# Altium schematic sheet PLWD_GNSS.SchDoc
size A4; SheetNumber: 4; SheetTotal: 6
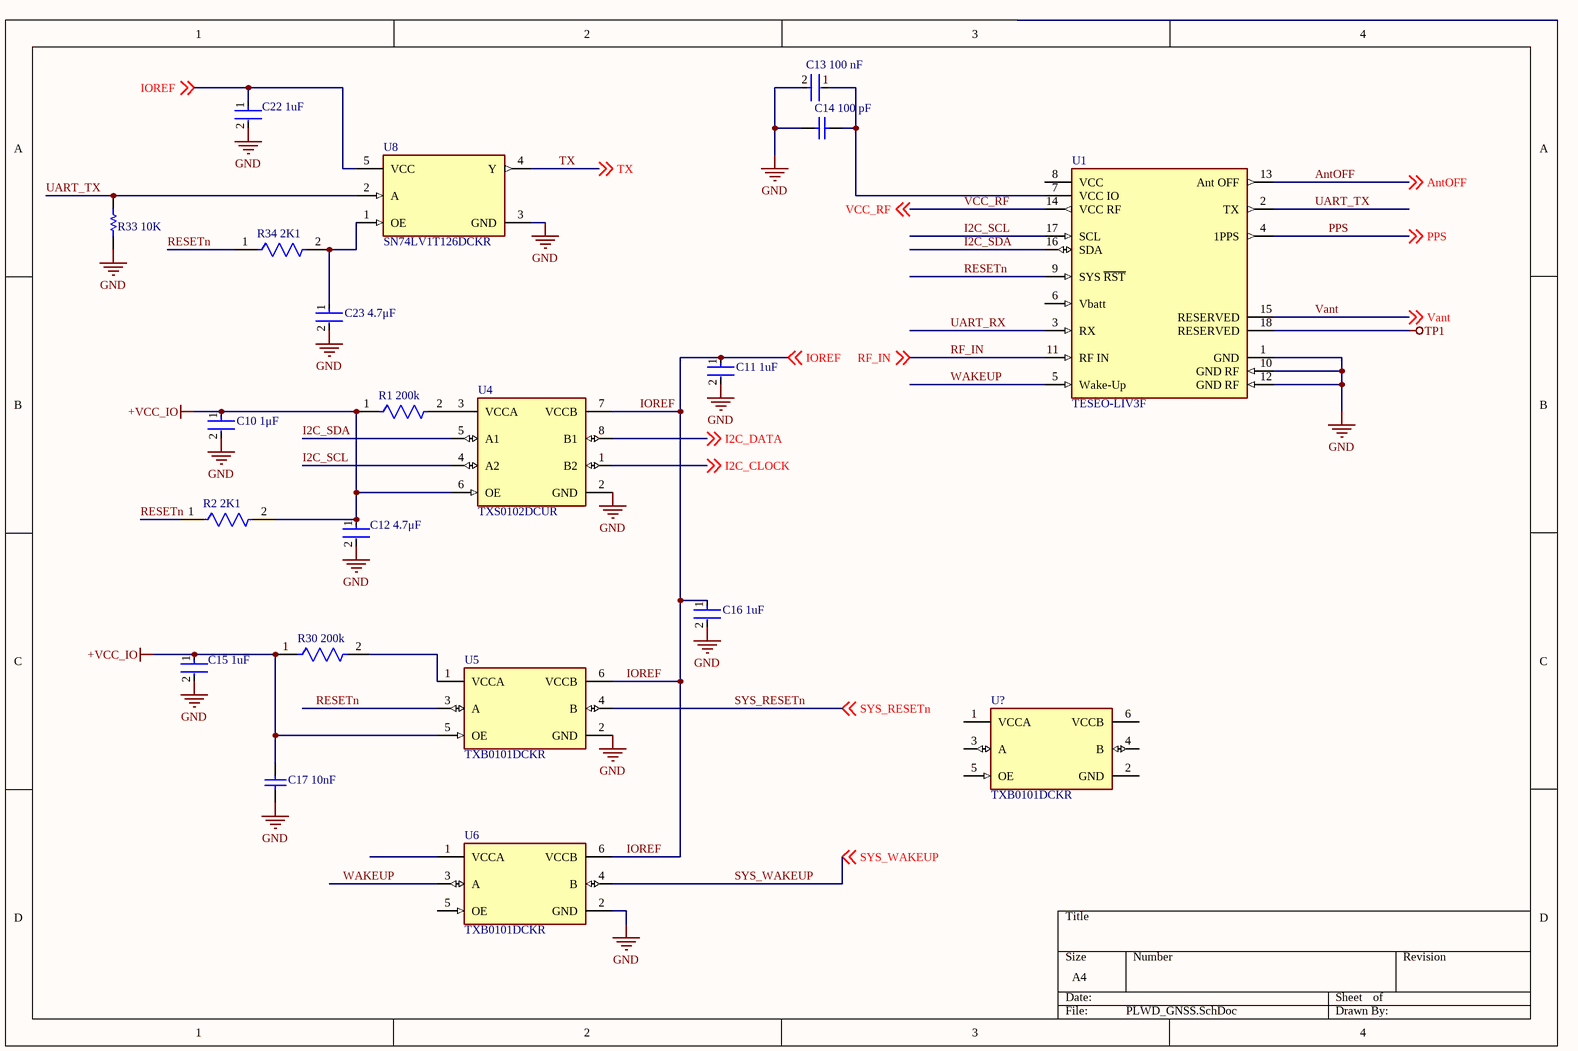
[diagram p0: PLWD_GNSS.SchDoc]

## Parts
C10_1μF  GRM155R60J475ME47D  [FP-GRM155-0_1-IPC_B]  (value not drawn)
C11_1uF  GRM155R61A105KE15D  [FP-GRM15-0_1-MFG]  (value not drawn)
C12_4.7μF  GRM155R60J475ME47D  [FP-GRM155-0_1-IPC_B]  (value not drawn)
C13_100_nF  GRM155R71C104KA88D  [FP-GRM15-MFG]  (value not drawn)
C14_100_pF  GRM1555C1H101JA01D  [CAPC1005X55X25ML05T10]  (value not drawn)
C15_1uF  GRM155R61A105KE15D  [FP-GRM15-0_1-MFG]  (value not drawn)
C16_1uF  GRM155R61A105KE15D  [FP-GRM15-0_1-MFG]  (value not drawn)
C17_10nF  GRM155R71E103KA01D  [CAPC1005X55X25LL05T10]  (value not drawn)
C22_1uF  GRM155R61A105KE15D  [FP-GRM15-0_1-MFG]  (value not drawn)
C23_4.7μF  GRM155R60J475ME47D  [FP-GRM155-0_1-IPC_B]  (value not drawn)
R1_200k  CRCW0603200KFKEAHP  [FP-CRCW0603-HPe3-MFG]  (value not drawn)
R2_2K1  CRCW06032K10FKEA  [FP-CRCW0603-e3-IPC_A]  (value not drawn)
R30_200k  CRCW2512200KFKEG  [FP-CRCW2512-e3-IPC_B]  (value not drawn)
R33_10K  ERJ3EKF1002V  [RESC1609X55X30LL15T15]  (value not drawn)
R34_2K1  CRCW06032K10FKEA  [FP-CRCW0603-e3-IPC_A]  (value not drawn)
U1  TESEO-LIV3F  [FP-LCC-18-MFG]
U4  TXS0102DCUR  [FP-DCU0008A-MFG]
U5  TXB0101DCKR  [FP-DCK0006A-MFG]
U6  TXB0101DCKR  [FP-DCK0006A-MFG]
U8  SN74LV1T126DCKR  [FP-DCK0005A-IPC_A]
U?  TXB0101DCKR  [FP-DCK0006A-MFG]

## Nets
+VCC_IO: C10_1μF.1 C12_4.7μF.1 C15_1uF.1 C17_10nF.1 R1_200k.1 R2_2K1.2 R30_200k.1 U4.6(OE) U5.5(OE)
GND: C10_1μF.2 C11_1uF.2 C12_4.7μF.2 C13_100_nF.2 C14_100_pF.1 C15_1uF.2 C16_1uF.2 C17_10nF.2 C22_1uF.2 C23_4.7μF.2 R33_10K.1 U1.1(GND) U1.10(GND_RF) U1.12(GND_RF) U4.2(GND) U5.2(GND) U6.2(GND) U8.3(GND)
TP1: U1.18(RESERVED)
AntOFF: U1.13(Ant_OFF) ; off-sheet AntOFF
I2C_CLOCK: U4.1(B2) ; off-sheet I2C_CLOCK
I2C_DATA: U4.8(B1) ; off-sheet I2C_DATA
I2C_SCL: U1.17(SCL) U4.4(A2)
I2C_SDA: U1.16(SDA) U4.5(A1)
IOREF: C11_1uF.1 C16_1uF.1 C22_1uF.1 U4.7(VCCB) U5.6(VCCB) U6.6(VCCB) U8.5(VCC) ; off-sheet IOREF
PPS: U1.4(1PPS) ; off-sheet PPS
RESETn: R2_2K1.1 R34_2K1.1 U1.9(SYS_~{RST}) U5.3(A)
RF_IN: U1.11(RF_IN) ; off-sheet RF_IN
SYS_RESETn: U5.4(B) ; off-sheet SYS_RESETn
SYS_WAKEUP: U6.4(B) ; off-sheet SYS_WAKEUP
TX: U8.4(Y) ; off-sheet TX
UART_RX: U1.3(RX)
UART_TX: R33_10K.2 U1.2(TX) U8.2(A)
Vant: U1.15(RESERVED) ; off-sheet Vant
VCC_RF: U1.14(VCC_RF) ; off-sheet VCC_RF
WAKEUP: U1.5(Wake-Up) U6.3(A)
NetC13_100_nF_1: C13_100_nF.1 C14_100_pF.2 U1.7(VCC_IO)
NetC23_4.7μF_1: C23_4.7μF.1 R34_2K1.2 U8.1(OE)
NetR1_200k_2: R1_200k.2 U4.3(VCCA)
NetR30_200k_2: R30_200k.2 U5.1(VCCA)

Not connected (* = marked no-connect by the designer): U1 6(Vbatt) 8(VCC); U6 1(VCCA) 5(OE); U? 1(VCCA) 2(GND) 3(A) 4(B) 5(OE) 6(VCCB)

## Library data of the parts
C10_1μF C12_4.7μF C23_4.7μF = CMP-2008-04549-2: Chip Multilayer Ceramic Capacitors for General Purpose, 0402, 4.7uF, X5R, 15%, 20%, 6.3V; Height: 0.5mm; Weight: 0.000212oz; Length: 1mm; Case Code (Metric): 1005; Packaging: Tape and Reel; Termination: SMD/SMT; Dielectric: X5R; Depth: 0.5mm; Case Code (Imperial): 0402; Min Operating Temperature: -55°C; Case/Package: 0402; Voltage: 6.3V; Width: 0.02inch; Capacitance: 4.7uF; Lead Free: Lead Free; Thickness: 0.022inch; Contact Plating: Tin; REACH SVHC: No SVHC; Package Quantity: 10000; Tolerance: 20%; Voltage Rating (DC): 6.3V; Voltage Rating: 6.3V; Mount: Surface Mount; Max Operating Temperature: 85°C
C11_1uF C15_1uF C16_1uF C22_1uF = CMP-2008-04556-2: CAP CER 1UF 10V X5R 0402; Manufacturer: Murata; Material: Ceramic; Tolerance: 10%; Temperature Coefficient: 15%; Octopart: https://octopart.com/grm155r61a105ke15d-murata-197442; Manufacturer Part Number: GRM155R61A105KE15D; Lead Free: Yes; ComponentLink2Description: Datasheet; Temperature: -55°C to +85°C; Temperature Range High: +85°C; Height: 0.55mm; Capacitance: 1uF; Ipc Land Pattern Name: CAPC10050X50; ComponentLink2URL: https://search.murata.co.jp/Ceramy/image/img/A01X/G101/ENG/GRM155R61A105KE15-01A.pdf; Temperature Range Low: -55°C; Device Class L2: Capacitors; Voltage Rating: 10V; RoHS: TRUE; Device Class L1: Passive Components; Device Class L3: Ceramic Capacitors; Temperature Characteristic: X5R; Mouser Description: 0402 1 uF 10 V ±10% Tolerance X5R Surface Mount Multilayer Ceramic Capacitor; Automotive: No; Package: GRM15-0.1; Digikey Description: CAP CER 1UF 10V X5R 0402; Value: 1uF; Category: Cap
C13_100_nF = CMP-2100-03641-2: CAP CER 0.1UF 16V X7R 0402; Manufacturer: Murata; Standoff Height: 0mm; Tolerance: 10%; Voltage Rating: 16Vdc; Material: Ceramic; Capacitance: 0.10μF; Value: 0.10μF; RoHS: TRUE; Manufacturer Part Number: GRM155R71C104KA88D; Temperature Characteristic: X7R; Octopart: https://octopart.com/grm155r71c104ka88d-murata-196880; Digikey Description: CAP CER 0.1UF 16V X7R 0402; Device Class L3: Ceramic Capacitors; Height: 0.55mm; ComponentLink2Description: Datasheet; Temperature Range Low: -55°C; Ipc Land Pattern Name: CAPC10050X219; ComponentLink2URL: https://search.murata.co.jp/Ceramy/image/img/A01X/G101/ENG/GRM155R71H471KA01-01A.pdf; Device Class L1: Passive Components; Lead Free: yes; Category: Cap; Package: GRM15; Temperature: -55°C to +125°C; Device Class L2: Capacitors; Temperature Range High: +125°C; Mouser Description: 0402 0.1 uF 16V ±10 % Tolerance X7R SMT Multilayer Ceramic Capacitor
C14_100_pF = CMP-2008-03915-1: Manufacturer: Murata; Part Number: GRM1555C1H101JA01D
C17_10nF = CMP-1034-01880-2: Manufacturer: Murata; Part Number: GRM155R71E103KA01D
R1_200k = CMP-02407-007717-1: RES Thick Film, 200kΩ, 1%, 0.33W, 100ppm/°C, 0603; Resistance: 200kR; Max Power Dissipation: 250mW; Tolerance: 1%; Composition: Thick Film; Features: Automotive AEC-Q200; Min Operating Temperature: -55°C; Case/Package: 0603; Length: 0.063inch; Max Operating Temperature: 155°C; Number of Terminations: 2; Height: 0.022inch; Military Standard: Not; Package Quantity: 5000; Width: 0.033inch; Temperature Coefficient: 100ppm/°C; Lead Free: Lead Free; Packaging: Tape and Reel; Depth: 0.85mm
R2_2K1 R34_2K1 = CMP-2000-03165-2: RES Thick Film, 2.1kΩ, 1%, 0.1W, 100ppm/°C, 0603; Voltage Rating (DC): 75V; Max Power Dissipation: 100mW; Resistance: 2.1kR; Min Operating Temperature: -55°C; Termination: SMD/SMT; Width: 0.033inch; Max Operating Temperature: 155°C; Composition: Thick Film; Temperature Coefficient: 100ppm/°C; Number of Pins: 2; Radiation Hardening: No; Tolerance: 1%; Height: 0.45mm; Working Voltage: 75V; Contact Plating: Tin; Number of Terminations: 2; Military Standard: Not; Voltage Rating: 75V; Mount: Surface Mount; Features: Automotive AEC-Q200; Depth: 0.85mm; Case/Package: 0603; Package Quantity: 10; Weight: 7.1E-05oz; Case Code (Metric): 1608; Lead Free: Lead Free; Packaging: Tape and Reel; Case Code (Imperial): 0603; Power Rating: 100mW; Length: 1.55mm
R30_200k = CMP-02407-005603-1: RES Thick Film, 200kΩ, 1%, 1W, 100ppm/°C, 2512; Resistance: 200kR; Voltage Rating: 500V; Lead Free: Lead Free; Height: 0.028inch; Package Quantity: 2000; Depth: 3.15mm; Tolerance: 1%; Length: 6.3mm; Number of Terminations: 2; Military Standard: Not; Temperature Coefficient: 100ppm/°C; Weight: 0.001429oz; Voltage Rating (DC): 500V; Composition: Thick Film; Case/Package: 2512; Termination: SMD/SMT; Case Code (Metric): 6432; Width: 0.124inch; Max Power Dissipation: 1W; Radiation Hardening: No; Min Operating Temperature: -55°C; Contact Plating: Tin; Packaging: Tape and Reel; Case Code (Imperial): 2512; Power Rating: 1W; Max Operating Temperature: 155°C
R33_10K = CMP-1012-00623-3: Chip Resistor, 10 KOhm, +/- 1%, 0.1 W, -55 to 155 degC, 0603 (1608 Metric), RoHS, Tape and Reel; Manufacturer: Panasonic; Voltage Rating: 75V; Case\/Package: 0603; Power Rating: 100mW; Resistance: 10KOhm; Temperature Coefficient: 100ppm\/degreesC; Number of Pins: 2; Package Reference: 603; Depth: 0.8mm; Mount: SurfaceMount; Package Description: 2-Pin Surface Mount Device, Body 1.6 x 0.85 mm; Datasheet Version: 02/2017; Length: 1.6mm; Lead Free: LeadFree; Height: 0.45mm; Number of Terminations: 2; Max Power Dissipation: 100mW; Min Operating Temperature: -55degC; Datasheet URL: https://industrial.panasonic.com/cdbs/www-data/pdf/RDA0000/AOA0000C304.pdf; Termination: SMD/SMT; Case Code (Metric): 1608; Case Code (Imperial): 0603; Tolerance: 1%; Max Operating Temperature: 155degC; RoHSCompliant: true; Voltage Rating (DC): 75V; Radiation Hardening: No; Packaging: TapeandReel; Composition: ThickFilm; Mounting Technology: SurfaceMount; Manufacturer URL: http://www.panasonic.com/; Width: 0.031inch; REACH SVHC: NoSVHC; Contact Plating: Tin; Military Standard: Not; Package Quantity: 1
U1 = CMP-12160-000003-1: RF RCVR GNSS/GPS 1.575GHZ 18LCC; Manufacturer: STMicroelectronics; Min Supply Voltage: 2.1V; Max Supply Voltage: 4.3V; Interface: I2C,UART; Sensitivity: -163dBm; Max Frequency: 1575.42MHz; ComponentLink2Description: Datasheet; Package: LCC-18; RoHS: TRUE; Temperature Range Low: -40°C; Manufacturer Part Number: TESEO-LIV3F; Ambient Temperature Range Low: -40°C; ComponentLink2URL: https://www.st.com/resource/en/datasheet/teseo-liv3f.pdf; Octopart: https://octopart.com/teseo-liv3f-stmicroelectronics-84762432; Device Class L1: Integrated Circuits (ICs); Mouser Description: Rf Receiver, 1.57542Ghz, -40 To 85Deg C; Digikey Description: RF RCVR GNSS/GPS 1.575GHZ 18LCC; Device Class L3: RF Receivers; Ambient Temperature Range High: +85°C; Temperature Range High: +85°C; Lead Free: Yes; Height: 2.33mm; Automotive: No; Category: UNK; Temperature: -40°C to +85°C; Device Class L2: RF Semiconductors and Devices
U4 = CMP-0859-00001-2: IC TRNSLTR BIDIRECTIONAL US8; Manufacturer: Texas Instruments; Number Of Circuits: 1; Number Of Inputs: 2; Data Rate: 24Mbits/s; Max Junction Temp: +150°C; V A Min: 1.65V; Standoff Height: 0mm; Logic Function Desc: Bidirectional Voltage-Level Translator; Max Supply Voltage: 5.5V; V A Max: 3.6V; Nominal Supply Current: 1-14.4uA; V B Min: 2.3V; Temperature: -40°C to +85°C; Temperature Range Low: -40°C; Height: 0.9mm; Device Class L1: Integrated Circuits (ICs); RoHS: TRUE; Min Supply Voltage: 1.65V; Digikey Description: IC TRNSLTR BIDIRECTIONAL US8; ComponentLink2Description: Datasheet; Octopart: https://octopart.com/txs0102dcur-texas+instruments-5414308; Temperature Range High: +85°C; Device Class L2: Logic ICs; Category: IC; Ambient Temperature Range High: +85°C; Automotive: No; Manufacturer Part Number: TXS0102DCUR; Device Class L3: Voltage Level Shifters; Number Of Outputs: 2; Ambient Temperature Range Low: -40°C; Lead Free: Yes; ComponentLink2URL: http://www.ti.com/lit/ds/symlink/txs0102.pdf; V B Max: 5.5V; Package: DCU0008A; Mouser Description: Translation - Voltage Levels 2-Bit Bi-Directional Voltage-Level-Trans
U5 U6 U? = CMP-04899-000110-1: IC TRNSLTR BIDIRECTIONAL SC70-6; Number of Bits: 1; Low Level Output Current: 20uA; Data Rate: 100Mbps; Logic Function: Translator; Min Supply Voltage: 1.2V; Turn-On Delay Time: 7.4ns; Propagation Delay: 31ns; High Level Output Current: -20uA; Max Supply Voltage: 5.5V; Series: -; Height: 1mm; Packaging: Tape and Reel; RoHS Compliant: Yes; Width: 1.4mm; Package Quantity: 1; Mount: Surface Mount; Case/Package: SC; Length: 2.15mm; Number of Pins: 6; Max Operating Temperature: 85°C; Contact Plating: Gold; Min Operating Temperature: -40°C; Radiation Hardening: No; Lead Free: Lead Free; Number of Inputs: 1; Number of Channels: 1; REACH SVHC: No SVHC
U8 = CMP-0859-00355-4: IC BUF NON-INVERT 5.5V SC70-5; Number of Inputs: 1; Operating Supply Current: 8mA; Propagation Delay: 16ns; High Level Output Current: -8mA; Quiescent Current: 1uA; Logic Function: Buffer; Min Supply Voltage: 1.6V; Polarity: Non-Inverting; Number of Pins: 5; Package Quantity: 3000; REACH SVHC: No SVHC; Case/Package: SC; Radiation Hardening: No; Lead Free: Lead Free; Number of Elements: 1; Number of Input Lines: 1; Number of Bits: 1; Max Operating Temperature: 125°C; Mount: Surface Mount; Number of Bits per Element: 1; Low Level Output Current: 8mA; RoHS Compliant: Yes; Number of Output Lines: 1; Weight: 0.000215oz; Number of Outputs: 1; Number of Channels: 1; Min Operating Temperature: -40°C; Contact Plating: Gold; Packaging: Tape and Reel; Max Supply Voltage: 5.5V